# EasyEDA Pro project PRJ_Feeder_V01c.epro, board LEDboard
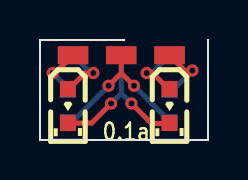
[diagram p11: board, top side]
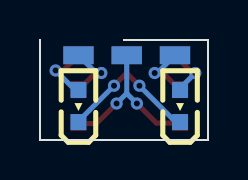
[diagram p12: board, bottom side, seen from below]

Outline 8.4 x 5 mm; copper layers: Top Layer, Bottom Layer. Coordinates in mm from the lower left corner of the outline.
Outline path: 0,5 0,0 ; 0,5 4.2,5 0,5 ; 0,5 0,0 ; 0,0 8.4,0 ; 0,0 8.4,0 ; 8.4,0 8.4,5 8.4,0
Stack: Top Layer 0.035mm / Dielectric1 1.51mm FR4 er 4.5 / Bottom Layer 0.035mm

## Design rules (mm)
template: JLCPCB Capability(Two Layers Board)
spacing copperThickness1oz (default): track to track 0.102, other pairs 0.152 to 0.3
spacing copperThickness2oz: track to track 0.203, other pairs 0.152 to 0.3
track width copperThickness1oz (default): min 0.127, default 0.254, max 2.54
track width copperThickness2oz: min 0.203, default 0.254, max 2.54
differential pair differentialPair (default): width min 0.127, default 0.254, max 2.54; gap min 0.152, default 0.152
via viaSize (default): diameter min 0.5, default 0.61, max 10; hole min 0.3, default 0.305, max 6.3

## Placement (name value [footprint] x y rotation side)
IR1  XL-1608HIRC-850  [OPTO-SMD_L1.6-W0.80-RD_XL-1608HIRC-850]  1.4 1.7 270 top
IR2  XL-1608HIRC-850  [OPTO-SMD_L1.6-W0.80-RD_XL-1608HIRC-850]  6.48 1.7 270 top
LED1  XL-1608PDC  [SENSOR-SMD_L1.6-W0.8-XL-1608PDC]  1.4 1.7 90 bottom
LED2  XL-1608PDC  [SENSOR-SMD_L1.6-W0.8-XL-1608PDC]  6.48 1.7 90 bottom
NOREF  -  [Pad_e15]  6.48 4.24 0 top
NOREF#2  -  [Pad_e18]  1.65 4.24 0 top
NOREF#3  -  [Pad_e17]  6.48 4.24 0 top
NOREF#4  -  [Pad_e16]  1.65 4.24 0 top
NOREF#5  -  [Pad_e14]  4.06 4.24 0 top
NOREF#6  -  [Pad_e12]  4.06 4.24 0 top

## Footprints (pads in the part's own frame, mm; a bottom-side part is the same pattern mirrored in y, then rotated)
OPTO-SMD_L1.6-W0.80-RD_XL-1608HIRC-850
  rect 0.8x0.8 smd: 1(0.851,0) 2(-0.851,0)
Pad_e12
  rect 1.524x0.9 smd: 1(0,0)
Pad_e14
  rect 1.524x0.9 smd far side: 1(0,0)
Pad_e15
  rect 1.524x0.9 smd: 1(0,0)
Pad_e16
  rect 1.524x0.9 smd: 1(0,0)
Pad_e17
  rect 1.524x0.9 smd far side: 1(0,0)
Pad_e18
  rect 1.524x0.9 smd far side: 1(0,0)
SENSOR-SMD_L1.6-W0.8-XL-1608PDC
  rect 0.8x0.8 smd: 1(-0.8,0) 2(0.8,0)

## Nets
3V3I: IR1.1 IR2.1 NOREF#5.1
3V3O: LED1.1 LED2.1 NOREF#6.1
IN1: IR1.2 NOREF#2.1
IN2: IR2.2 NOREF#3.1
OUT1: LED1.2 NOREF#4.1
OUT2: LED2.2 NOREF.1

## Via types
v1: diameter 0.61, hole 0.305, Top Layer to Bottom Layer, 8 vias

## Routing (per net, layer and track width the routed paths; a pad name or vN(x,y) marks a point on that pad's centre or on a via; arc(x,y) is an arc through that point)
3V3I: length 8.2
  Top Layer w0.254: v1(3.56,1.83) 2.58,0.85 1.45,0.85 ; v1(4.57,1.83) 5.58,0.82 6.45,0.82
  Bottom Layer w0.254: 4.06,2.33 v1(3.56,1.83) ; 4.06,2.33 v1(4.57,1.83) ; 4.06,2.33 NOREF#5.1
3V3O: length 8.2
  Top Layer w0.254: 4.06,3.35 v1(4.7,2.71) ; 4.06,3.35 v1(3.43,2.71) ; 4.06,3.35 NOREF#6.1
  Bottom Layer w0.254: v1(4.7,2.71) 6.54,0.87 6.58,0.87 ; 1.32,0.92 1.64,0.92 v1(3.43,2.71)
IN1: length 2.9
  Top Layer w0.254: 1.45,2.55 2.25,3.35 v1(2.67,3.35)
  Bottom Layer w0.254: NOREF#2.1 2.54,3.35 v1(2.67,3.35)
IN2: length 3
  Top Layer w0.254: 6.45,2.52 5.63,3.35 v1(5.33,3.35)
  Bottom Layer w0.254: NOREF#3.1 5.59,3.35 v1(5.33,3.35)
OUT1: length 2.5
  Top Layer w0.254: NOREF#4.1 0.76,3.35 v1(0.63,3.35)
  Bottom Layer w0.254: v1(0.63,3.35) 1.32,2.66 1.32,2.52
OUT2: length 2.9
  Top Layer w0.254: v1(7.62,3.48) 7.24,3.48 NOREF.1
  Bottom Layer w0.254: 6.58,2.47 6.62,2.47 v1(7.62,3.48)

## Text on the board
Top Silkscreen Layer: 0.1a
